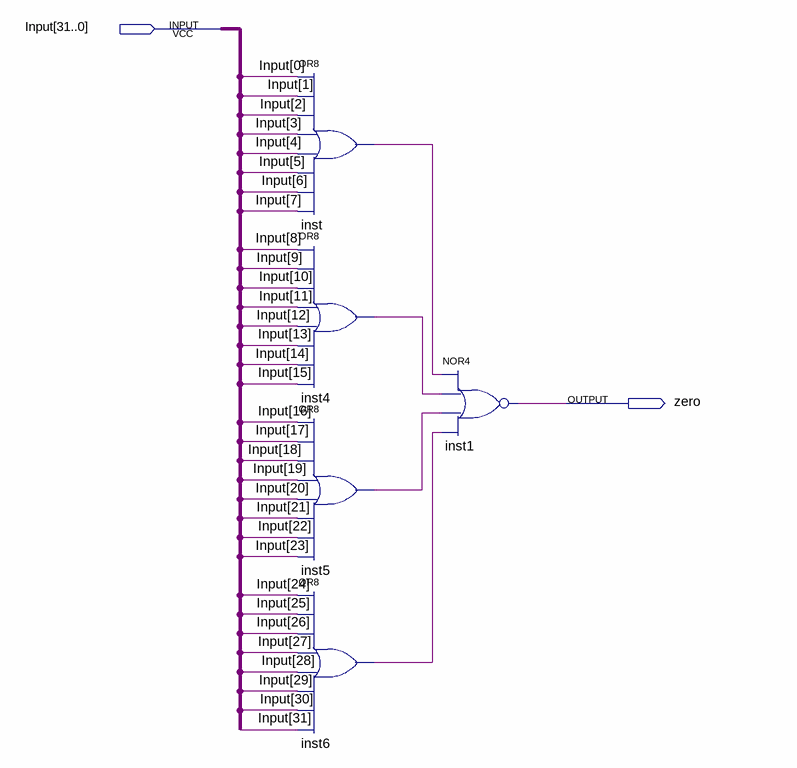
[diagram p0: schematic sheet]
// Quartus schematic zero.bdf as structural Verilog: 5 symbols, 2 pins
module zero (
  input  [31:0] Input,
  output zero
);

  wire inst4_out, inst5_out, inst6_out, inst_out;

  or inst (inst_out, Input[0], Input[1], Input[2], Input[3], Input[4], Input[5], Input[6], Input[7]);
  or inst4 (inst4_out, Input[8], Input[9], Input[10], Input[11], Input[12], Input[13], Input[14], Input[15]);
  or inst5 (inst5_out, Input[16], Input[17], Input[18], Input[19], Input[20], Input[21], Input[22], Input[23]);
  or inst6 (inst6_out, Input[24], Input[25], Input[26], Input[27], Input[28], Input[29], Input[30], Input[31]);
  nor inst1 (zero, inst_out, inst4_out, inst5_out, inst6_out);
endmodule
